# EAGLE design Pi2RMini 2.0 (EAGLE 6.1)
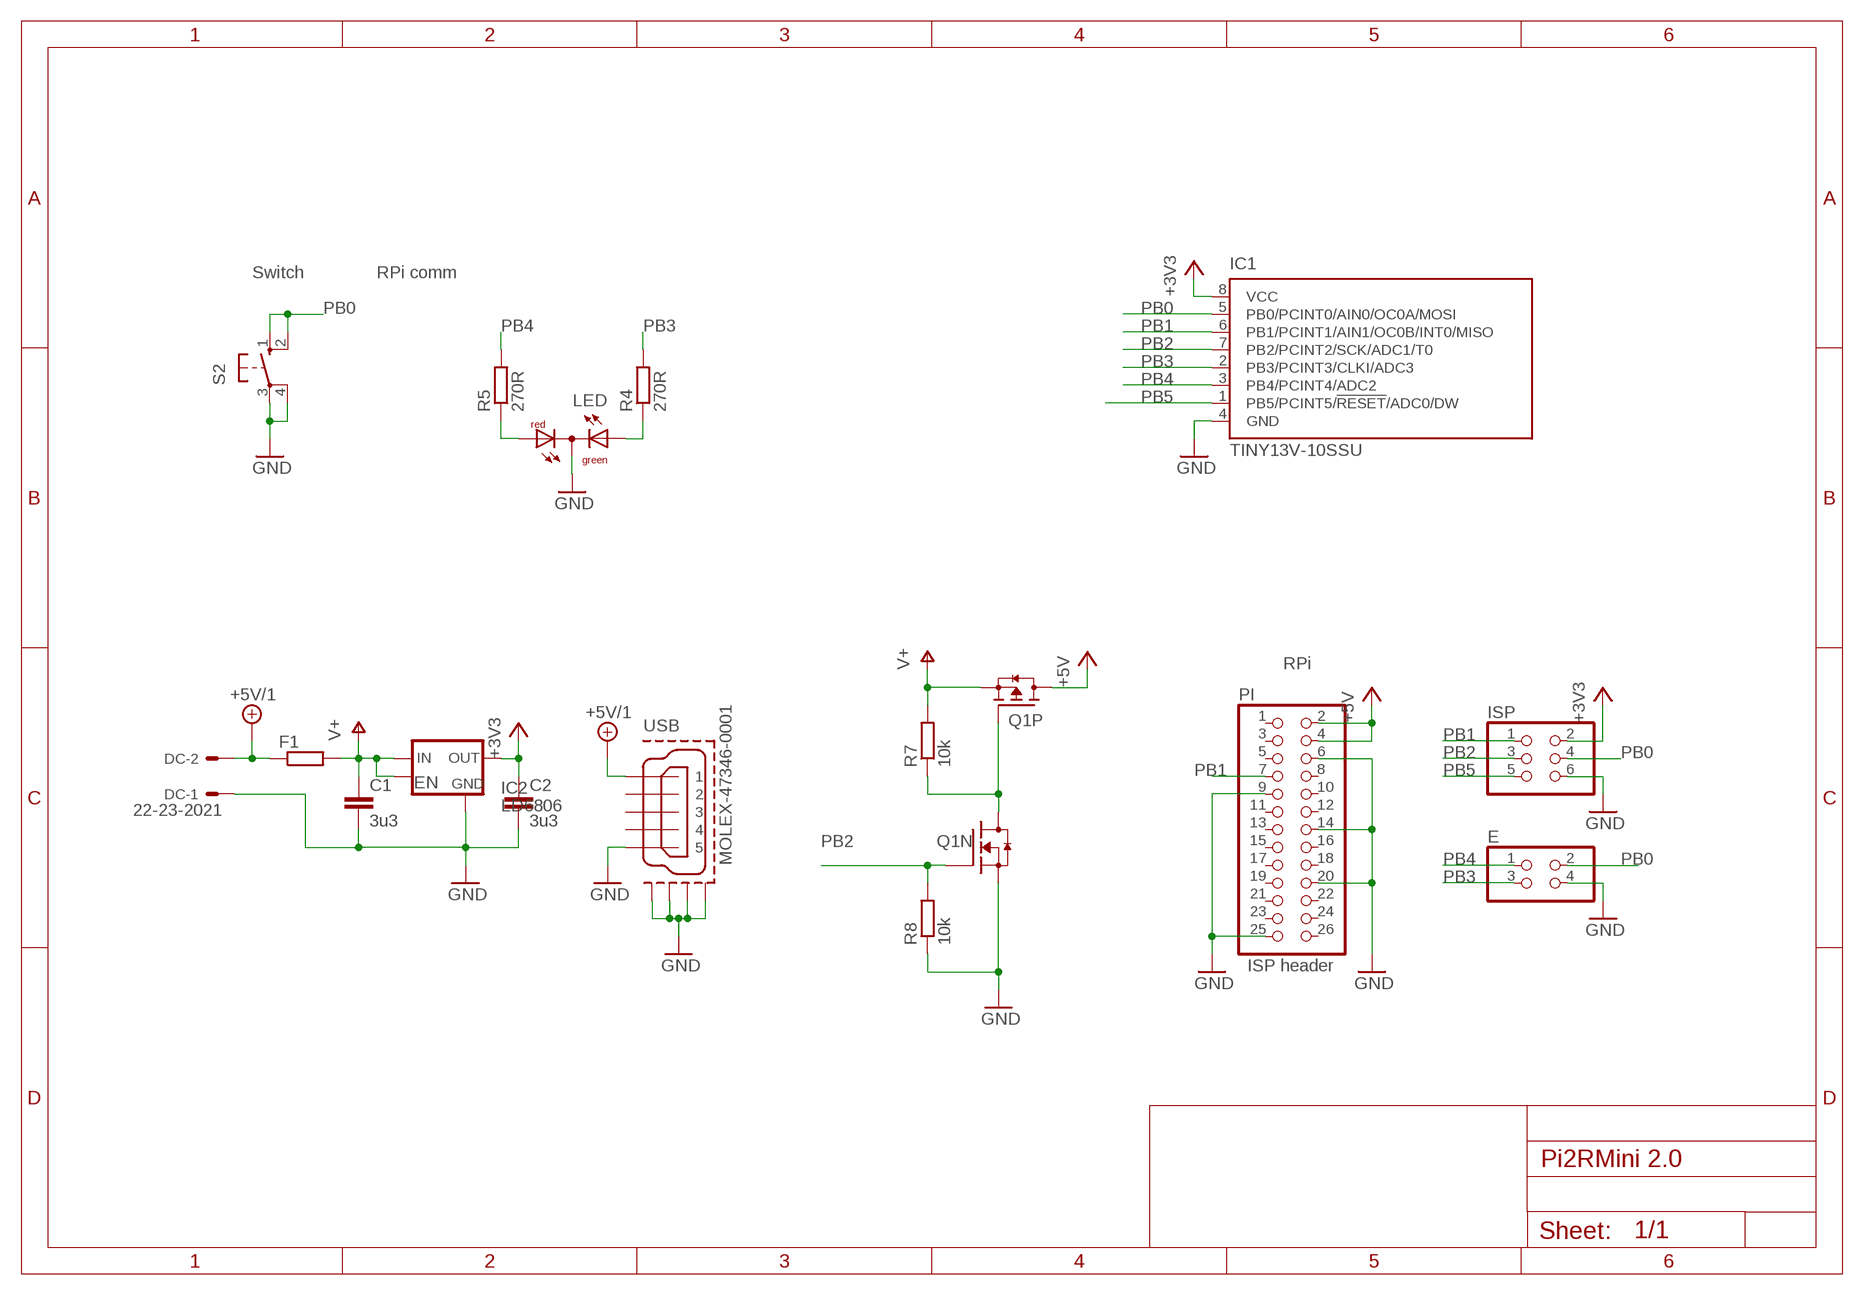
[diagram p0: schematic, sheet 1]

## Parts
C1  3u3  C-EUC0603  [C0603]
C2  3u3  C-EUC0603  [C0603]
DC  22-23-2021  [22-23-2021]
E  PINHD-2X2  [2X02]
F1  R-EU_R1210  [R1210]
IC1  TINY13V-10SSU  [8S1]
IC2  LD6806  [SOT-753]
ISP  PINHD-2X3  [2X03]
LED  DUOLED-CC  [SOT-23]
PI  PINHD-2X13  [2X13]
Q1  BSL215  [6TSOP]
R4  270R  R-EU_R0603  [R0603]
R5  270R  R-EU_R0603  [R0603]
R7  10k  R-EU_R0603  [R0603]
R8  10k  R-EU_R0603  [R0603]
S2  10-XX  [B3F-10XX]
USB  MOLEX-47346-0001  [MOLEX-47364-0001]

## Nets
+3V3: C2.1 IC1.8(VCC) IC2.5(OUT) ISP.2
+5V: PI.2 PI.4 Q1.4(P:D)
+5V/1: DC.2 F1.1 USB.1
GND: C1.2 C2.2 DC.1 E.4 IC1.4(GND) IC2.2(GND) ISP.6 LED.3(C) PI.6 PI.9 PI.14 PI.20 PI.25 Q1.5(N:S) R8.1 S2.3(P) S2.4(P1) USB.5 USB.GND1 USB.GND2 USB.GND3 USB.GND4
N$12: Q1.3(P:G) Q1.6(N:D) R7.1
PB0: E.2 IC1.5(PB0/PCINT0/AIN0/OC0A/MOSI) ISP.4 S2.1(S) S2.2(S1)
PB1: IC1.6(PB1/PCINT1/AIN1/OC0B/INT0/MISO) ISP.1 PI.7
PB2: IC1.7(PB2/PCINT2/SCK/ADC1/T0) ISP.3 Q1.1(N:G) R8.2
PB3: E.3 IC1.2(PB3/PCINT3/CLKI/ADC3) R4.2
PB3': LED.2(AG) R4.1
PB4: E.1 IC1.3(PB4/PCINT4/ADC2) R5.2
PB4': LED.1(AR) R5.1
PB5: IC1.1(PB5/PCINT5/!RESET!/ADC0/DW) ISP.5
V+: C1.1 F1.2 IC2.1(IN) IC2.3(EN) Q1.2(P:S) R7.2
Unconnected: PI.1 PI.3 PI.5 PI.8 PI.10 PI.11 PI.12 PI.13 PI.15 PI.16 PI.17 PI.18 PI.19 PI.21 PI.22 PI.23 PI.24 PI.26 USB.2 USB.3 USB.4

## Notes on the sheet
- Switch | RPi comm
- RPi
- ISP header

## Library data of the parts
C1 C2 = rcl:C-EU: CAPACITOR, European symbol
DC = con-molex:22-23-2021: .100" (2.54mm) Center Header - 2 Pin; MF: MOLEX; MPN: 22-23-2021; OC_FARNELL: 1462926; OC_NEWARK: 25C3832
E = pinhead:PINHD-2X2: PIN HEADER
F1 R4 R5 R7 R8 = rcl:R-EU_: RESISTOR, European symbol
IC1 = atmel:TINY13: 8-bit AVR Microcontroller with 1K Bytes In-System Programmable Flash Source: http://www.atmel.com/dyn/resources/prod_documents/2535S.pdf; MPN: ATTINY13V-10SSU; OC_FARNELL: 1455135; OC_NEWARK: 58M3773
IC2 = AWJLEagleLib:LD6806: NXP LD6806 LDO regulator
ISP = pinhead:PINHD-2X3: PIN HEADER
LED = AWJLEagleLib:DUOLED-CC: Dual colour LED
PI = pinhead:PINHD-2X13: PIN HEADER
Q1 = AWJLEagleLib:BSL215: Infineon BSL215 dual N/P MOSFET
S2 = switch-omron:10-XX: OMRON SWITCH; MPN: B3F-1000; OC_FARNELL: 176432; OC_NEWARK: 36M3542
USB = usb_con-update:MOLEX-47346-0001: MICRO USB B, BOTTOM MOUNT

## Board
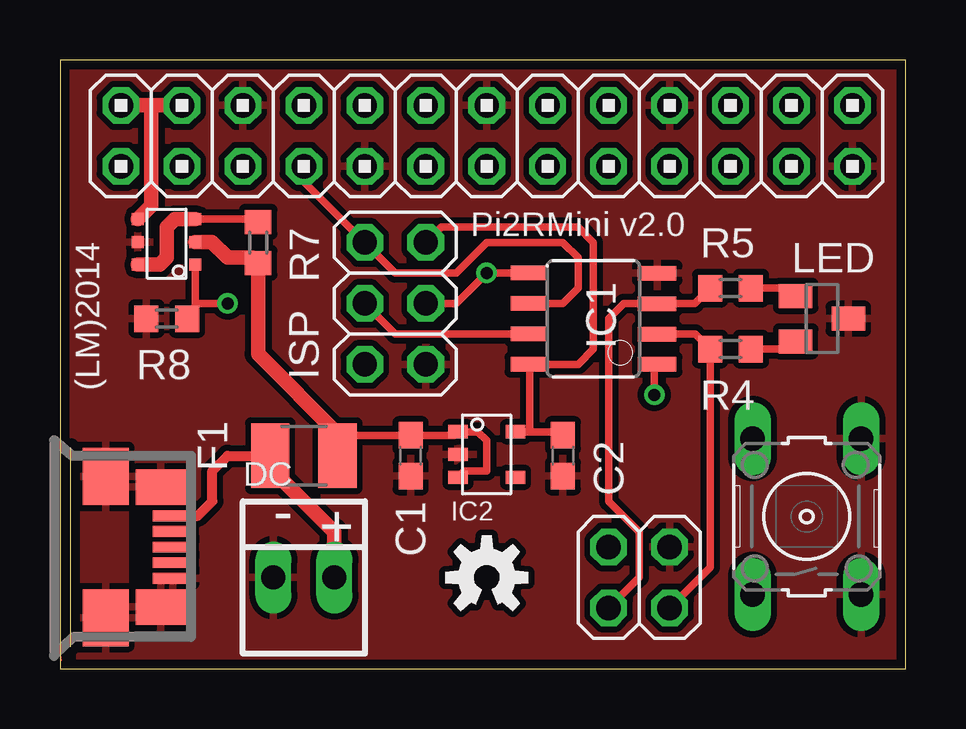
[diagram p1: board, top side]
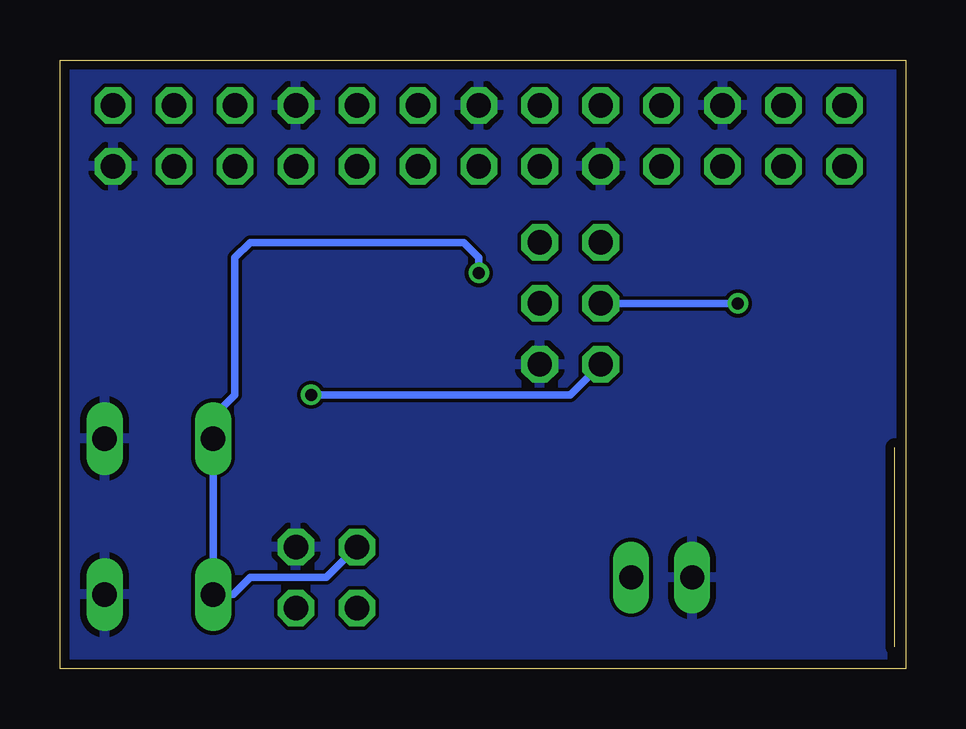
[diagram p2: board, bottom side, seen from below]

Size 35.23 x 25.39 mm. Coordinates in mm from the lower left corner, seen from the top.
Outline: 0,0 35.23,0 35.23,25.39 0,25.39 0,0
Copper layers (1*16): Top 0.0356mm / dielectric 1.5011mm / Bottom 0.0356mm
Design rules: minimum track width 6mil, minimum drill 13mil, track to track 6mil, track to pad 6mil, pad to pad 6mil, via to via 6mil, smd to smd 6mil, copper to edge 15mil, drill to drill 6mil, minimum pad ring 7mil, minimum via ring 7mil, stop-mask expansion 4mil, vias tented up to drill 0mil, thermal gap 10mil

### Footprints (pad centres in the part's own frame; a part is rotated, then mirrored left to right if it is on the bottom)
C0603 = smd 1.1 x 1: 1 -0.85,0; 2 0.85,0
22-23-2021 = drill 1 long: 1 -1.27,0; 2 1.27,0
2X02 = drill 1.016 octagon: 1 -1.27,-1.27; 2 -1.27,1.27; 3 1.27,-1.27; 4 1.27,1.27
R1210 = smd 1.6 x 2.7: 1 -1.4,0; 2 1.4,0
8S1 = smd 0.6 x 1.6: 1 -1.905,-2.654; 2 -0.645,-2.654; 3 0.625,-2.654; 4 1.895,-2.654; 5 1.905,2.654; 6 0.635,2.654; 7 -0.635,2.654; 8 -1.905,2.654
SOT-753 = smd 0.55 x 0.8: 1 -1,-1.2; 2 -0.05,-1.2; 3 0.9,-1.2; 4 0.9,1.2; 5 -1,1.2
2X03 = drill 1.016 octagon: 1 -2.54,-1.27; 2 -2.54,1.27; 3 0,-1.27; 4 0,1.27; 5 2.54,-1.27; 6 2.54,1.27
SOT-23 = smd 1 x 1.4: 1 -0.95,-1.1; 2 0.95,-1.1; 3 0,1.1
2X13 = drill 1.016 octagon: 1 -15.24,-1.27; 2 -15.24,1.27; 3 -12.7,-1.27; 4 -12.7,1.27; 5 -10.16,-1.27; 6 -10.16,1.27; 7 -7.62,-1.27; 8 -7.62,1.27; 9 -5.08,-1.27; 10 -5.08,1.27; 11 -2.54,-1.27; 12 -2.54,1.27; 13 0,-1.27; 14 0,1.27; 15 2.54,-1.27; 16 2.54,1.27; 17 5.08,-1.27; 18 5.08,1.27; 19 7.62,-1.27; 20 7.62,1.27; 21 10.16,-1.27; 22 10.16,1.27; 23 12.7,-1.27; 24 12.7,1.27; 25 15.24,-1.27; 26 15.24,1.27
6TSOP = smd 0.5 x 0.5: 1 -0.925,-1.2; 2 0.025,-1.2; 3 0.975,-1.2; 4 0.975,1.2; 5 0.025,1.2; 6 -0.925,1.2
R0603 = smd 1 x 1.1: 1 -0.85,0; 2 0.85,0
B3F-10XX = drill 1.016 long: 1 -3.251,2.261; 2 3.251,2.261; 3 -3.251,-2.261; 4 3.251,-2.261
MOLEX-47364-0001 = smd 1.7 x 0.45: 1 2.8,1.3; 2 2.8,0.65; 3 2.8,0; 4 2.8,-0.65; 5 2.8,-1.3 | smd 1.9 x 2.375: GND1 0,2.95; GND4 0,-2.95 | smd 2.1 x 1.475: GND2 2.3,2.5; GND3 2.3,-2.5

### Placement (x,y rotation side)
C1  14.61,8.89 270 top
C2  20.95,8.89 270 top
DC  10.16,3.81 0 top
E  24.13,3.81 0 top
F1  10.16,8.89 0 top
IC1  22.23,14.61 90 top
IC2  17.78,8.89 270 top
ISP  13.97,15.24 270 top
LED  31.75,14.61 270 top
PI  17.78,22.23 0 top
Q1  4.45,17.78 90 top
R4  27.94,13.34 180 top
R5  27.94,15.88 180 top
R7  8.26,17.78 270 top
R8  4.45,14.61 0 top
S2  31.11,6.35 90 top
USB  1.91,5.08 0 top

### Tracks (layer width: path | path; a pad name or v marks a point on that pad's centre or on a via)
+3V3
  Top 0.305: IC2.5 19.68,9.89 | 19.68,9.89 20.8,9.89 C2.1 | ISP.2 15.88,18.41 21.59,18.41 22.23,17.78 22.23,13.34 21.59,12.7 IC1.8 19.57,10 19.68,9.89
+5V
  Top 0.61: 3.81,23.5 PI.4 | PI.2 3.81,23.5 | 3.81,23.5 3.81,19.32 Q1.4
+5V/1
  Top 0.406: USB.1 5.75,6.38 6.35,6.99 6.35,8.26 6.99,8.89 F1.1
  Top 0.61: F1.1 8.76,8.38 11.43,5.71 DC.2
GND
  pour Top (isolate 0.254): 0,25.4 35.56,25.4 35.56,0 0,0
  pour Bottom: 0,25.4 35.56,25.4 35.56,0 0,0
N$1
  Top 0.01: 0.08,0.34 0.06,0.5
N$3
  Top 0.01: 18.24,2.7 arc10 18.42,2.79 18.86,2.43 19.16,2.73 18.8,3.17 arc19 18.95,3.54 19.52,3.6 19.52,4.02 18.95,4.08 arc19 18.8,4.45 19.16,4.89 18.86,5.19 18.42,4.83 arc19 18.05,4.98 17.99,5.55 17.57,5.55 17.51,4.98 arc19 17.14,4.83 16.7,5.19 16.4,4.89 16.76,4.45 arc19 16.61,4.08 16.04,4.02 16.04,3.6 16.61,3.54 arc19 16.76,3.17 16.4,2.73 16.7,2.43 17.14,2.79 arc10 17.32,2.7 17.57,3.31 arc-67 17.23,3.81 arc-247 17.99,3.31 18.24,2.7
N$12
  Top 0.305: Q1.3 8.13,18.75 R7.1
  Top 0.61: Q1.6 4.16,16.86 4.45,17.14 4.45,18.41 4.79,18.75 Q1.3
PB0  (via drill 0.5)
  Top 0.305: ISP.4 16.51,15.24 v17.78,16.51 IC1.5
  Bottom 0.305: E.2 24.13,3.81 27.3,3.81 28.02,3.1 S2.1 S2.2 28.78,9.53 28.78,10.59 27.94,11.43 27.94,17.14 27.3,17.78 18.41,17.78 17.78,17.14 v17.78,16.51
PB1
  Top 0.305: PI.7 10.16,20.32 ISP.1 13.97,16.51 16.51,16.51 17.78,17.78 20.95,17.78 21.59,17.14 21.59,15.88 20.95,15.24 IC1.6
PB2  (via drill 0.5)
  Top 0.305: Q1.1 5.64,15.24 | 5.64,15.24 5.64,14.96 R8.2 | IC1.7 13.97,13.97 ISP.3 | v6.99,15.24 5.64,15.24
  Bottom 0.305: ISP.3 v6.99,15.24
PB3
  Top 0.305: IC1.2 26.46,13.96 R4.2 27.09,4.23 E.3
PB3'
  Top 0.305: R4.1 30.33,13.34 LED.2
PB4
  Top 0.305: R5.2 26.45,15.23 IC1.3 23.48,15.23 22.86,14.61 22.86,6.99 24.13,5.71 24.13,3.81 E.1
PB4'
  Top 0.305: R5.1 30.33,15.88 LED.1
PB5  (via drill 0.5)
  Top 0.305: v24.77,11.43 24.77,12.59 IC1.1
  Bottom 0.305: ISP.5 13.97,11.43 v24.77,11.43
V+
  Top 0.305: F1.2 11.43,9.02 11.43,9.53 11.64,9.74 C1.1 16.43,9.74 IC2.1 17.41,9.89 17.78,9.53 17.78,8.26 16.84,8.26 IC2.3
  Top 0.61: 11.64,9.74 8.26,13.13 R7.2 8.04,17.14 6.99,17.14 6.33,17.8 Q1.2

### Text on the board
tPlace: Pi2RMini v2.0 | (LM)2014 | - | +